# EasyEDA schematic schematic.json
TITLE: Messy Schematic; REV: 1.0; Date: 2024-03-07; Sheet: 1/1; Drawn By: bajajshaunak; Company: Usb Creator
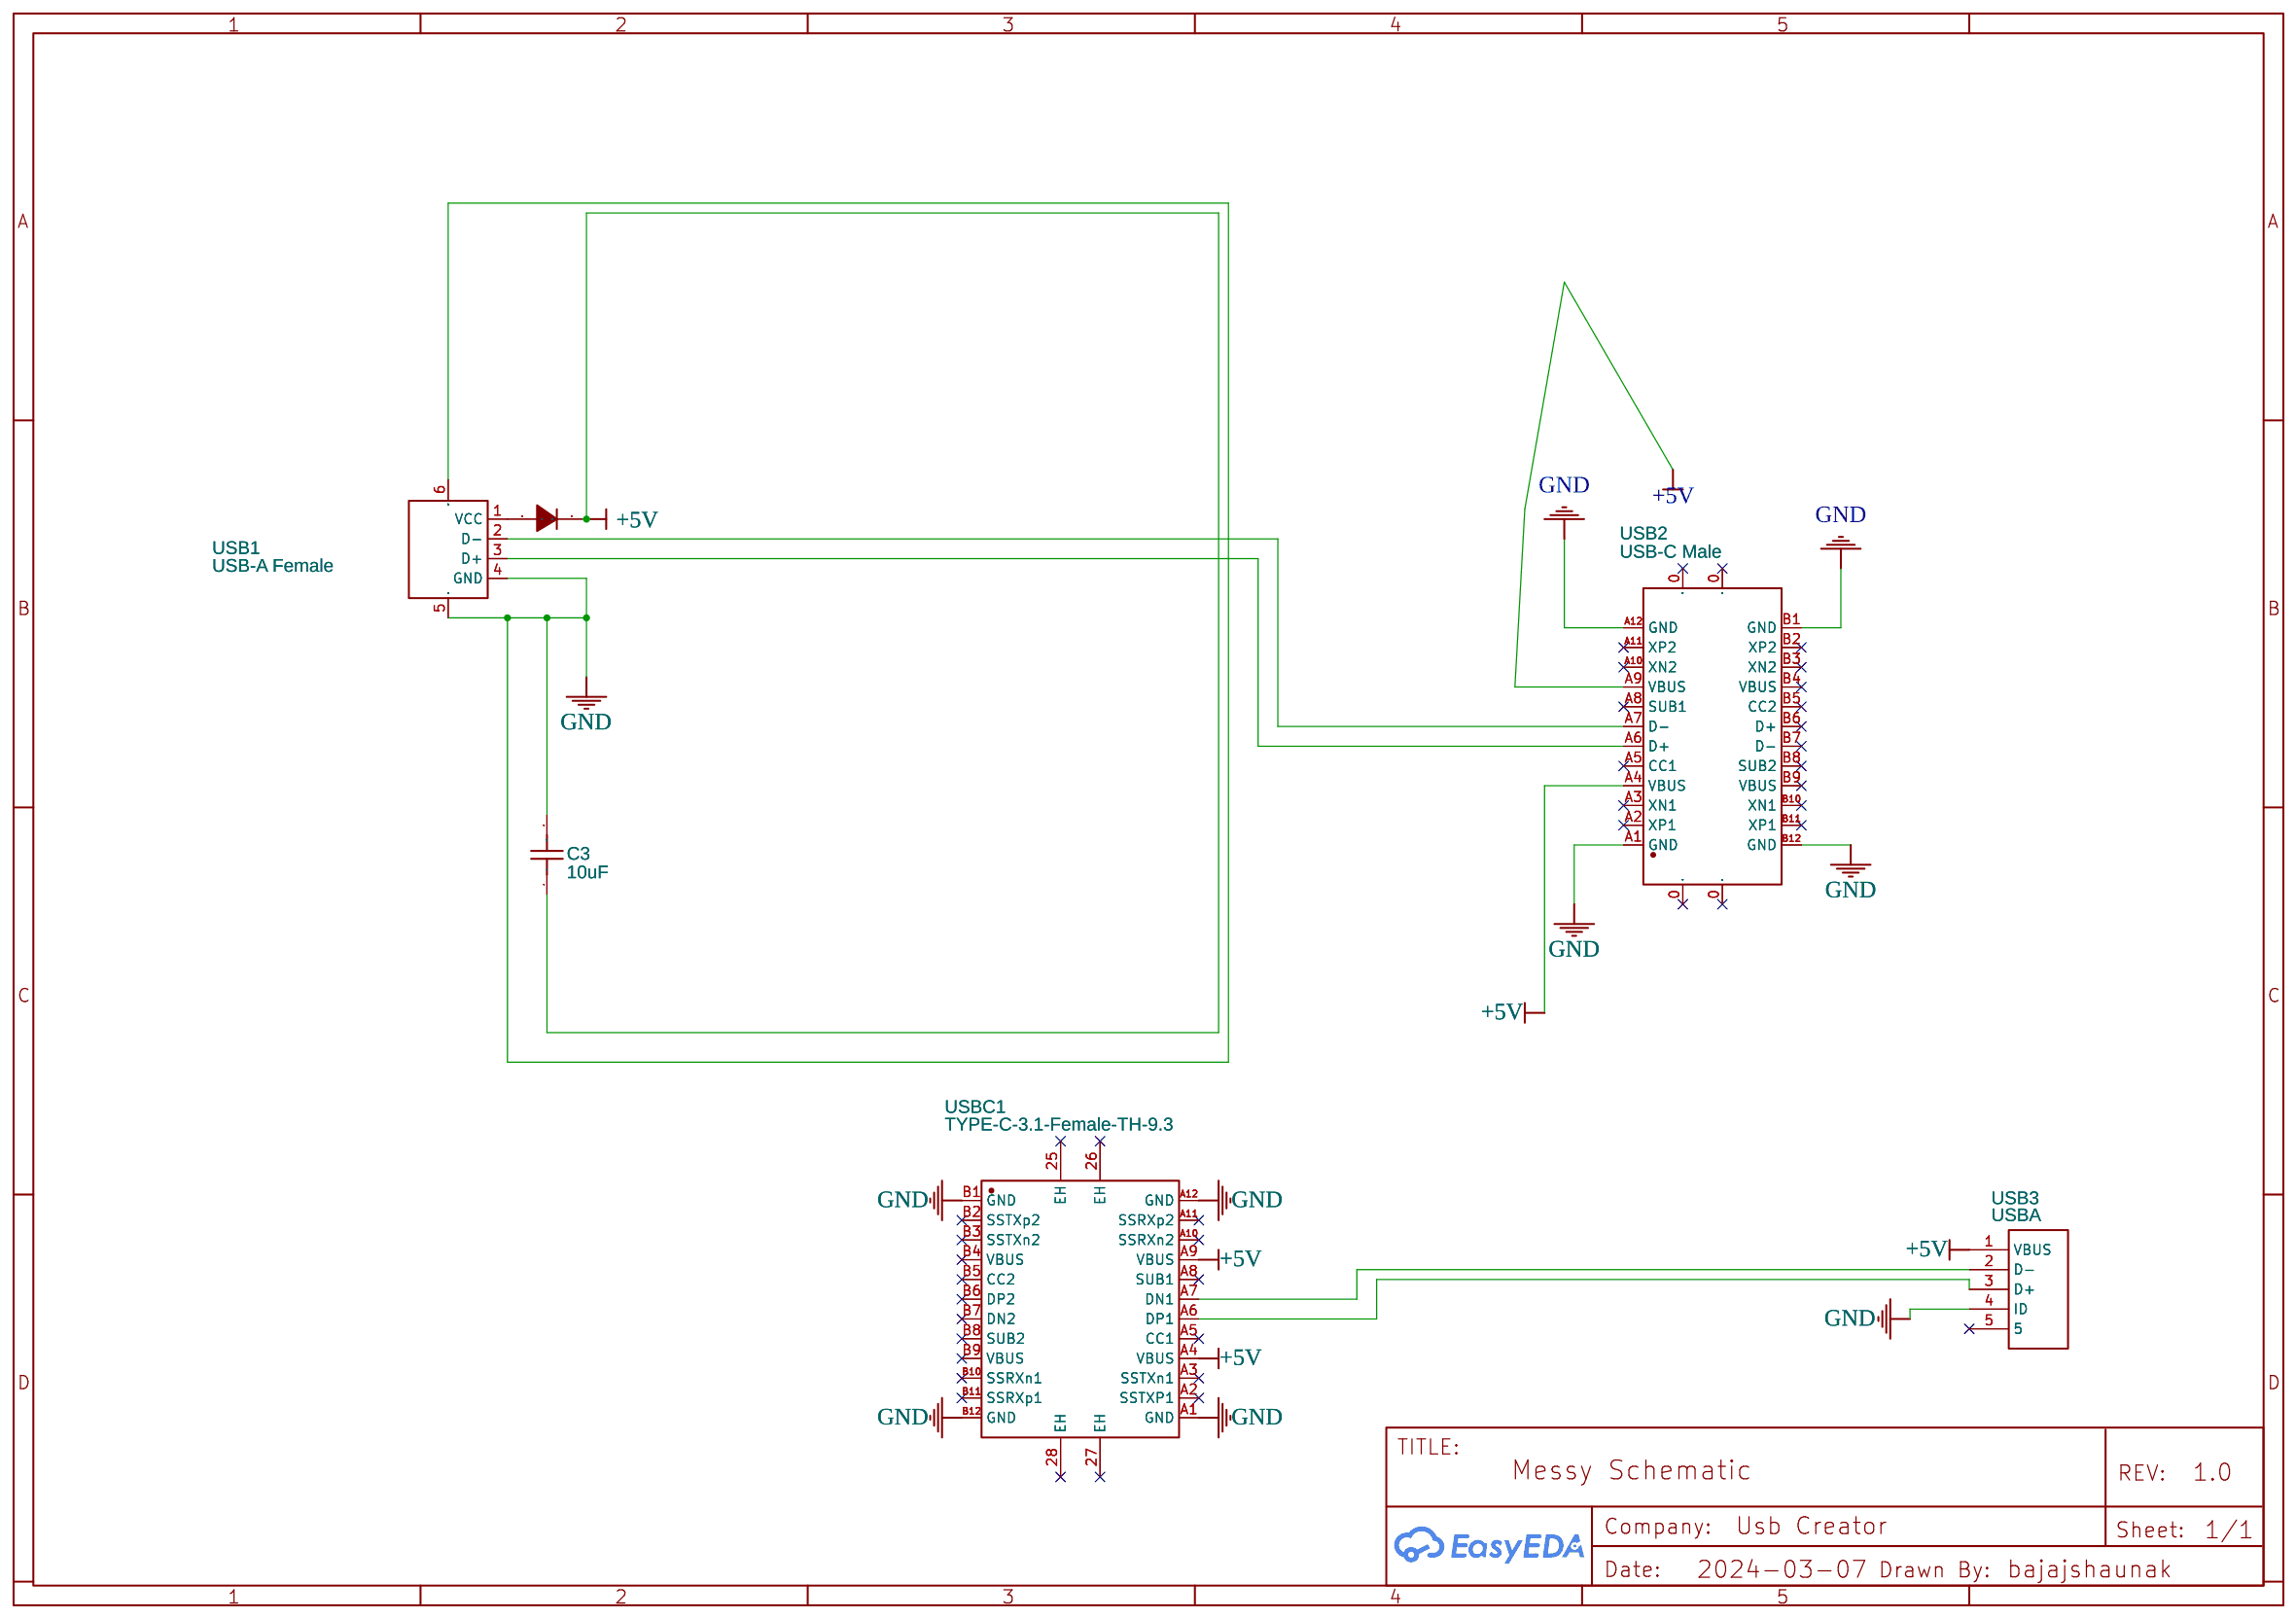
[diagram p0: schematic sheet]

## Parts
C3  10uF  [C0603]
D2  NSR0320MW2T1G  [SOD-323_L1.8-W1.3-LS2.5-RD]
USB1  USB-A Female  [USB-A-TH_USB-AF-DIP-154-HW-S]
USB2  USB-C Male  [USB-C-SMD_28P-P0.50-L11.0-W8.6]
USB3  USBA  [USB-A-TH_U-USBAR04P-M002]
USBC1  TYPE-C-3.1-Female-TH-9.3  [USB-C-SMD_TYPE-C-3.1-FEMALE-TH-9.3]

## Library data of the parts
C3 = CL10A106KP8NNNC: Supplier: LCSC; Manufacturer: SAMSUNG(三星); Supplier Part: C19702; JLCPCB Part Class: Basic Part
D2 = NSR0320MW2T1G: Supplier: LCSC; Manufacturer: onsemi(安森美); Supplier Part: C48192; JLCPCB Part Class: Extended Part
USB1 = USB-AF-DIP-154-HW-S: Contributor: LCSC; Supplier: LCSC; Supplier Part: C2904892; Manufacturer: 皇捷; JLCPCB Part Class: Extended Part
USB2 = USB-307HI: Contributor: LCSC; Supplier: LCSC; Supplier Part: C309357; Manufacturer: HOOYA(皓宇电子); JLCPCB Part Class: Extended Part
USB3 = U-USBAR04P-M002: Contributor: LCSC; Supplier: LCSC; Supplier Part: C386753; Manufacturer: Ckmtw(灿科盟); Manufacturer Part: U-USBAR04P-M001; JLCPCB Part Class: Extended Part
USBC1 = TYPE-C-3.1-Female-TH-9.3: Contributor: LCSC; Supplier: LCSC; Supplier Part: C168703; Manufacturer: 精拓金; Manufacturer Part: 918-418K2022Y40004; JLCPCB Part Class: Extended Part

## Nets
+5V: C3.1 D2.1(C) USB2.A4(VBUS) USB2.A9(VBUS) USB3.1(VBUS) USBC1.A4(VBUS) USBC1.A9(VBUS)
GND: C3.2 USB1.4(GND) USB1.5(SH1) USB1.6(SH2) USB2.A1(GND) USB2.A12(GND) USB2.B1(GND) USB2.B12(GND) USB3.4(ID) USBC1.A1(GND) USBC1.A12(GND) USBC1.B1(GND) USBC1.B12(GND)
Net-(D2-2): D2.2(A) USB1.1(VCC)
Net-(USB1-2): USB1.2(D-) USB2.A7(D-)
Net-(USB1-3): USB1.3(D+) USB2.A6(D+)
Net-(USB3-2): USB3.2(D-) USBC1.A7(DN1)
Net-(USB3-3): USB3.3(D+) USBC1.A6(DP1)

Not connected (* = marked no-connect by the designer): USB2 0* A2(XP1)* A3(XN1)* A5(CC1)* A8(SUB1)* A10(XN2)* A11(XP2)* B2(XP2)* B3(XN2)* B4(VBUS)* B5(CC2)* B6(D+)* B7(D-)* B8(SUB2)* B9(VBUS)* B10(XN1)* B11(XP1)*; USB3 5*; USBC1 25(EH)* 26(EH)* 27(EH)* 28(EH)* A2(SSTXP1)* A3(SSTXn1)* A5(CC1)* A8(SUB1)* A10(SSRXn2)* A11(SSRXp2)* B2(SSTXp2)* B3(SSTXn2)* B4(VBUS)* B5(CC2)* B6(DP2)* B7(DN2)* B8(SUB2)* B9(VBUS)* B10(SSRXn1)* B11(SSRXp1)*
